# EAGLE design Arduino_Nano (EAGLE 9.6.2)
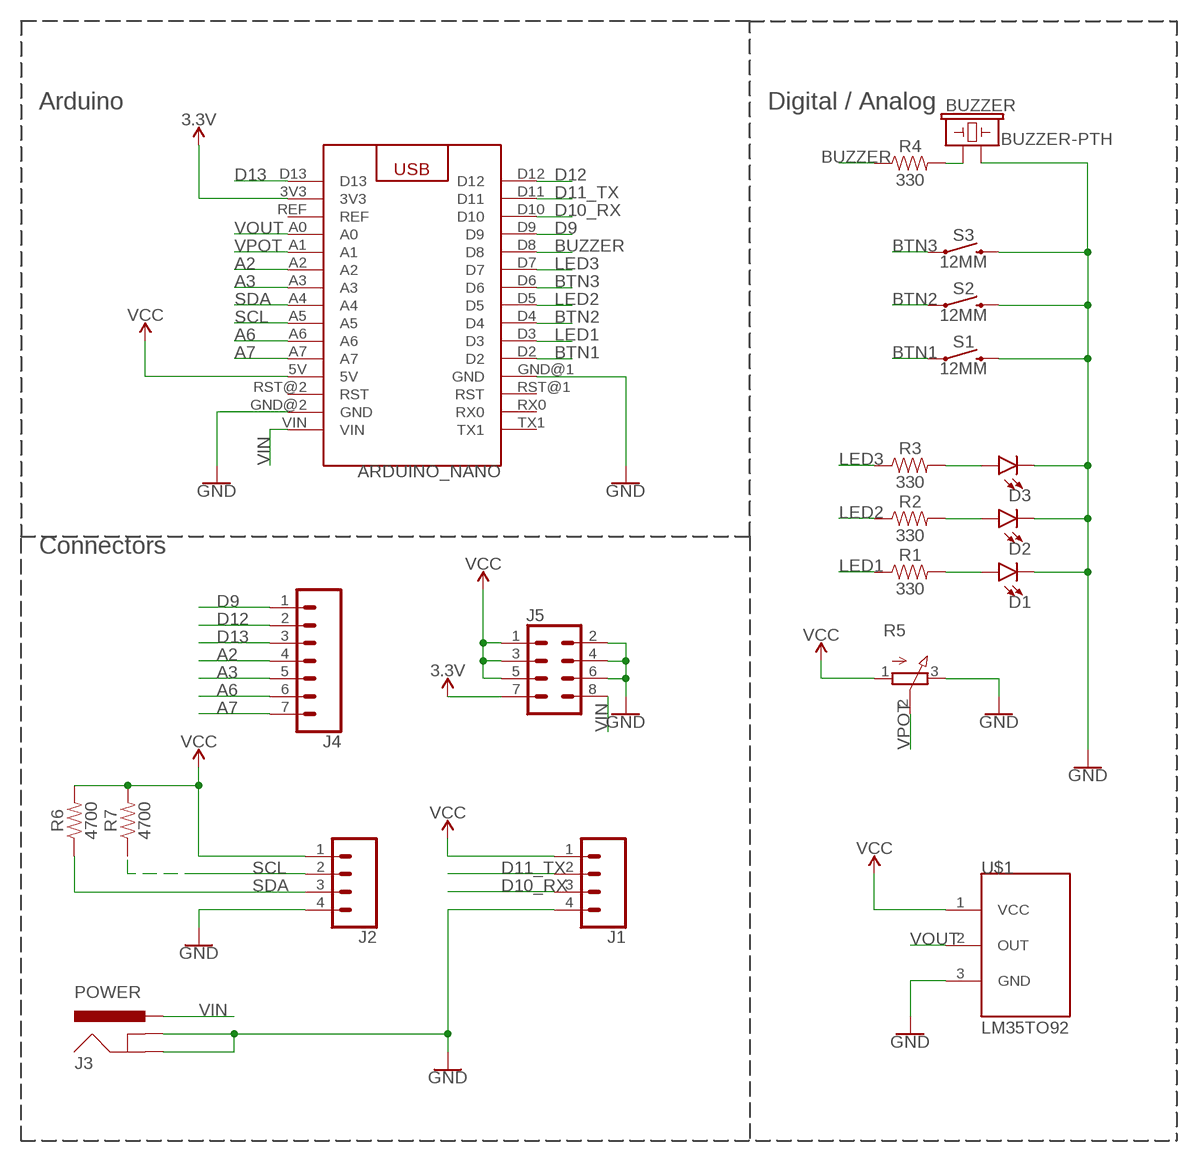
[diagram p0: schematic, sheet 1]

## Parts
ARDUINO_NANO  ARDUINO_NANO  [ARDUINO_NANO]
BUZZER  BUZZER-PTH  [BUZZER-12MM]
D1  LED-3MM-NO_SILK  [LED_3MM-NS]
D2  LED-3MM-NO_SILK  [LED_3MM-NS]
D3  LED-3MM-NO_SILK  [LED_3MM-NS]
J1  CONN_04PTH  [1X04]
J2  CONN_04PTH  [1X04]
J3  POWER  POWER_JACK  [POWER_JACK_PTH]
J4  CONN_07  [1X07]
J5  CONN_04X2  [2X4]
R1  330  1KOHM-HORIZ-1/4W-1%  [AXIAL-0.3]
R2  330  1KOHM-HORIZ-1/4W-1%  [AXIAL-0.3]
R3  330  1KOHM-HORIZ-1/4W-1%  [AXIAL-0.3]
R4  330  1KOHM-HORIZ-1/4W-1%  [AXIAL-0.3]
R5  3RP/1610N  [3RP/1610N]
R6  4700  1KOHM-HORIZ-1/4W-1%  [AXIAL-0.3]
R7  4700  1KOHM-HORIZ-1/4W-1%  [AXIAL-0.3]
S1  12MM  MOMENTARY-SWITCH-SPST-PTH-12MM  [TACTILE_SWITCH_PTH_12MM]
S2  12MM  MOMENTARY-SWITCH-SPST-PTH-12MM  [TACTILE_SWITCH_PTH_12MM]
S3  12MM  MOMENTARY-SWITCH-SPST-PTH-12MM  [TACTILE_SWITCH_PTH_12MM]
U$1  LM35TO92  [LM35TO92]

## Nets
3.3V: ARDUINO_NANO.3V3 J5.7
A2: ARDUINO_NANO.A2 J4.4
A3: ARDUINO_NANO.A3 J4.5
A6: ARDUINO_NANO.A6 J4.6
A7: ARDUINO_NANO.A7 J4.7
BTN1: ARDUINO_NANO.D2 S1.1
BTN2: ARDUINO_NANO.D4 S2.1
BTN3: ARDUINO_NANO.D6 S3.1
BUZZER: ARDUINO_NANO.D8 R4.P$1
D9: ARDUINO_NANO.D9 J4.1
D10_RX: ARDUINO_NANO.D10 J1.3
D11_TX: ARDUINO_NANO.D11 J1.2
D12: ARDUINO_NANO.D12 J4.2
D13: ARDUINO_NANO.D13 J4.3
GND: ARDUINO_NANO.GND@2(GND) BUZZER.- D1.K(C) D2.K(C) D3.K(C) J1.4 J2.4 J3.GND J3.GNDBREAK J5.2 J5.4 J5.6 R5.3(E) S1.3 S2.3 S3.3 U$1.3(GND)
LED1: ARDUINO_NANO.D3 R1.P$1
LED2: ARDUINO_NANO.D5 R2.P$1
LED3: ARDUINO_NANO.D7 R3.P$1
N$1: BUZZER.+ R4.P$2
N$2: ARDUINO_NANO.GND@1(GND) ; supply symbol labelled GND
N$3: D3.A R3.P$2
N$4: D2.A R2.P$2
N$5: D1.A R1.P$2
SCL: ARDUINO_NANO.A5 J2.2 R7.P$1
SDA: ARDUINO_NANO.A4 J2.3 R6.P$1
VCC: ARDUINO_NANO.5V J1.1 J2.1 J5.1 J5.3 J5.5 R5.1(A) R6.P$2 R7.P$2 U$1.1(VCC)
VIN: ARDUINO_NANO.VIN J3.PWR J5.8
VOUT: ARDUINO_NANO.A0 U$1.2(OUT)
VPOT: ARDUINO_NANO.A1 R5.2(S)
Unconnected: ARDUINO_NANO.REF ARDUINO_NANO.RST@1(RST) ARDUINO_NANO.RST@2(RST) ARDUINO_NANO.RX0 ARDUINO_NANO.TX1

## Notes on the sheet
- Arduino | Digital / Analog
- Connectors

## Library data of the parts
ARDUINO_NANO = LRTlib:ARDUINO_NANO: Arduino Nano Device
BUZZER = SparkFun-Electromechanical:BUZZER: Buzzer Small round buzzers that operate around the audible 2kHz range. You can use these as speakers to create simple music or user interfaces. Variant Overview: PTH - Mini Speaker - PC Mount 12mm 2.048kHz <https://www.sparkfun.com/products/7950> PTH_KIT - Mini Speaker - PC Mount 12mm 2.048kHz <https://www.sparkfun.com/products/7950> KIT simplifies soldering by adding stop mask to one side of the pads. PTH_NO_SILK - Mini Speaker - PC Mount 12mm 2.048kHz <https://www.sparkfun.com/products/7950> No silkscreen indicator of buzzer outline. PTH_KIT_NO_SILK - Mini Speaker - PC Mount 12mm 2.048kHz <https://www.sparkfun.com/products/7950> KIT package w/o silkscreen SMD - Buzzer Audio Magnetic (CCV-084B16) SMD buzzer used on, e.g. the LilyPad Buzzer <https://www.sparkfun.com/products/8463> and RFID USB Reader <https://www.sparkfun.com/products/9963>. SMD_KIT - Buzzer Audio Magnetic (CCV-084B16) SMD Buzzer with elongated pins to make soldering easier. Used on the SparkFun Simon Says - Surface Mount Soldering Kit <https://www.sparkfun.com/products/10935>. SMD-SQUARE - Buzzer Audio Magnetic (COMP-15701) SMT square buzzer with one chamfered corner.; PROD_ID: COMP-08253; SF_SKU: COM-07950
D1-D3 = SparkFun-LED:LED: LED (Generic) Standard schematic elements and footprints for 5mm, 3mm, 1206, and 0603 sized LEDs. Generic LEDs with no color specified.
J1 J2 = SparkFun-Connectors:CONN_04: Multi connection point. Often used as Generic Header-pin footprint for 0.1 inch spaced/style header connections On any of the 0.1 inch spaced packages, you can populate with these: Break Away Headers - Straight <https://www.sparkfun.com/products/116> (PRT-00116) Break Away Male Headers - Right Angle <https://www.sparkfun.com/products/553> (PRT-00553) Female Headers <https://www.sparkfun.com/products/115> (PRT-00115) Break Away Headers - Machine Pin <https://www.sparkfun.com/products/117> (PRT-00117) Break Away Female Headers - Swiss Machine Pin <https://www.sparkfun.com/products/743> (PRT-00743) For SCREWTERMINALS and SPRING TERMINALS visit here: Screw Terimnals on SparkFun.com <https://www.sparkfun.com/search/results?term=Screw+Terminals> (5mm/3.5mm/2.54mm spacing) This device is also useful as a general connection point to wire up your design to another part of your project. Our various solder wires solder well into these plated through hole pads. Hook-Up Wire - Assortment (Stranded, 22 AWG) <https://www.sparkfun.com/products/11375> (PRT-11375) Hook-Up Wire - Assortment (Solid Core, 22 AWG) <https://www.sparkfun.com/products/11367> (PRT-11367) View the entire wire category on our website here <https://www.sparkfun.com/categories/141> Special notes: Molex polarized connector foot print use with SKU : PRT-08231 with associated crimp pins and housings. 1MM SMD Version SKU: PRT-10208; PROD_ID: CONN-09696
J3 = SparkFun-Connectors:POWER_JACK: Power Jack Connector This is the standard 5.5mm barrel jack for power. The PTH is the most common, proven, reliable, footprint. The Slot footprint only works if the mill layer is transmitted to the PCB fab house so be warned. Here are the connectors we sell at SparkFun: DC Barrel Power Jack/Connector <https://www.sparkfun.com/products/119> (PRT-00119) DC Barrel Power Jack/Connector (SMD) <https://www.sparkfun.com/products/12748> (PRT-12748) DC Barrel Jack Adapter - Breadboard Compatible <https://www.sparkfun.com/products/10811> (PRT-10811) It is used on this SparkFun product (and many, many others): SparkFun RedBoard - Programmed with Arduino <https://www.sparkfun.com/products/12757> (DEV-12757) Also, if you need a mating power supply or connector, please check these out: Wall Adapter Power Supply - 9VDC 650mA <https://www.sparkfun.com/products/298> (TOL-00298) DC Barrel Jack Adapter - Male <https://www.sparkfun.com/products/10287> (PRT-10287); PROD_ID: CONN-08197
J4 = SparkFun-Connectors:CONN_07: Multi connection point. Often used as Generic Header-pin footprint for 0.1 inch spaced/style header connections On any of the 0.1 inch spaced packages, you can populate with these: Break Away Headers - Straight <https://www.sparkfun.com/products/116> (PRT-00116) Break Away Male Headers - Right Angle <https://www.sparkfun.com/products/553> (PRT-00553) Female Headers <https://www.sparkfun.com/products/115> (PRT-00115) Break Away Headers - Machine Pin <https://www.sparkfun.com/products/117> (PRT-00117) Break Away Female Headers - Swiss Machine Pin <https://www.sparkfun.com/products/743> (PRT-00743) For SCREWTERMINALS and SPRING TERMINALS visit here: Screw Terimnals on SparkFun.com <https://www.sparkfun.com/search/results?term=Screw+Terminals> (5mm/3.5mm/2.54mm spacing) This device is also useful as a general connection point to wire up your design to another part of your project. Our various solder wires solder well into these plated through hole pads. Hook-Up Wire - Assortment (Stranded, 22 AWG) <https://www.sparkfun.com/products/11375> (PRT-11375) Hook-Up Wire - Assortment (Solid Core, 22 AWG) <https://www.sparkfun.com/products/11367> (PRT-11367) View the entire wire category on our website here <https://www.sparkfun.com/categories/141> Special notes: Molex polarized connector foot print use with SKU : PRT-08231 with associated crimp pins and housings. 1MM SMD Version SKU: PRT-10208 NOTES ON THE VARIANTS LOCK and LOCK_LONGPADS... This footprint was designed to help hold the alignment of a through-hole component (i.e. 6-pin header) while soldering it into place. You may notice that each hole has been shifted either up or down by 0.005 of an inch from it's more standard position (which is a perfectly straight line). This slight alteration caused the pins (the squares in the middle) to touch the edges of the holes. Because they are alternating, it causes a "brace" to hold the component in place. 0.005 has proven to be the perfect amount of "off-center" position when using our standard breakaway headers. Although looks a little odd when you look at the bare footprint, once you have a header in there, the alteration is very hard to notice. Also,if you push a header all the way into place, it is covered up entirely on the bottom side.
J5 = SparkFun-Connectors:CONN_04X2: Multi connection point. Often used as Generic Header-pin footprint for 0.1 inch spaced/style header connections On any of the 0.1 inch spaced packages, you can populate with these: Break Away Headers - Straight <https://www.sparkfun.com/products/116> (PRT-00116) Break Away Male Headers - Right Angle <https://www.sparkfun.com/products/553> (PRT-00553) Female Headers <https://www.sparkfun.com/products/115> (PRT-00115) Break Away Headers - Machine Pin <https://www.sparkfun.com/products/117> (PRT-00117) Break Away Female Headers - Swiss Machine Pin <https://www.sparkfun.com/products/743> (PRT-00743)
R1-R4 R6 R7 = SparkFun-Resistors:1KOHM: 1kΩ resistor A resistor is a passive two-terminal electrical component that implements electrical resistance as a circuit element. Resistors act to reduce current flow, and, at the same time, act to lower voltage levels within circuits. - Wikipedia; PROD_ID: RES-12182; VALUE: 1k
R5 = pot:3RP/1610N: 16mm Potentiometer one level Source: http://www.alphapotentiometers.net/html/16mm_pot_2.html
S1-S3 = SparkFun-Switches:MOMENTARY-SWITCH-SPST: Momentary Switch (Pushbutton) - SPST Normally-open (NO) SPST momentary switches (buttons, pushbuttons). Variants PTH-12MM - 12mm square, through-hole Momentary Pushbutton Switch - 12mm Square <https://www.sparkfun.com/products/9190> (COM-09190) PTH-6.0MM, PTH-6.0MM-KIT - 6.0mm square, through-hole Mini Pushbutton Switch <https://www.sparkfun.com/products/97> (COM-00097) KIT package intended for soldering kit's - only one side of pads' copper is exposed. PTH-RIGHT-ANGLE-KIT - Right-angle, through-hole Right Angle Tactile Button <https://www.sparkfun.com/products/10791> - Used on SparkFun BigTime Watch Kit <https://www.sparkfun.com/products/11734> SMD-12MM - 12mm square, surface-mount Tactile Button - SMD (12mm) <https://www.sparkfun.com/products/12993> (COM-12993) Used on SparkFun PicoBoard <https://www.sparkfun.com/products/11888> SMD-4.5MM - 4.5mm Square Trackball Switch Used on SparkFun Blackberry Trackballer Breakout <https://www.sparkfun.com/products/13169> SMD-4.6MMX2.8MM - 4.60mm x 2.80mm, surface mount Used on SparkFun Pro Micro - RP2040 <https://www.sparkfun.com/products/17717> SMD-5.2MM, SMD-5.2-REDUNDANT - 5.2mm square, surface-mount Mini Pushbutton Switch - SMD <https://www.sparkfun.com/products/8720> (COM-08720) Used on Arduino Pro Mini <https://www.sparkfun.com/products/11114> REDUNDANT package connects both switch circuits together SMD-6.0X3.5MM - 6.0 x 3.5mm, surface mount Momentary Reset Switch SMD <https://www.sparkfun.com/products/8229> (COM-08229) SMD-6.2MM-TALL - 6.2mm square, surface mount Tactile Button - SMD (6mm) <https://www.sparkfun.com/products/12992> Used on SparkFun Digital Sandbox <https://www.sparkfun.com/products/12651> SMD-RIGHT-ANGLE - Right-angle, surface mount Used on SparkFun Block for Intel® Edison - Arduino <https://www.sparkfun.com/products/13036>; PROD_ID: SWCH-09185; SF_SKU: COM-09190
U$1 = LRTlib:LM35TO92

## Board
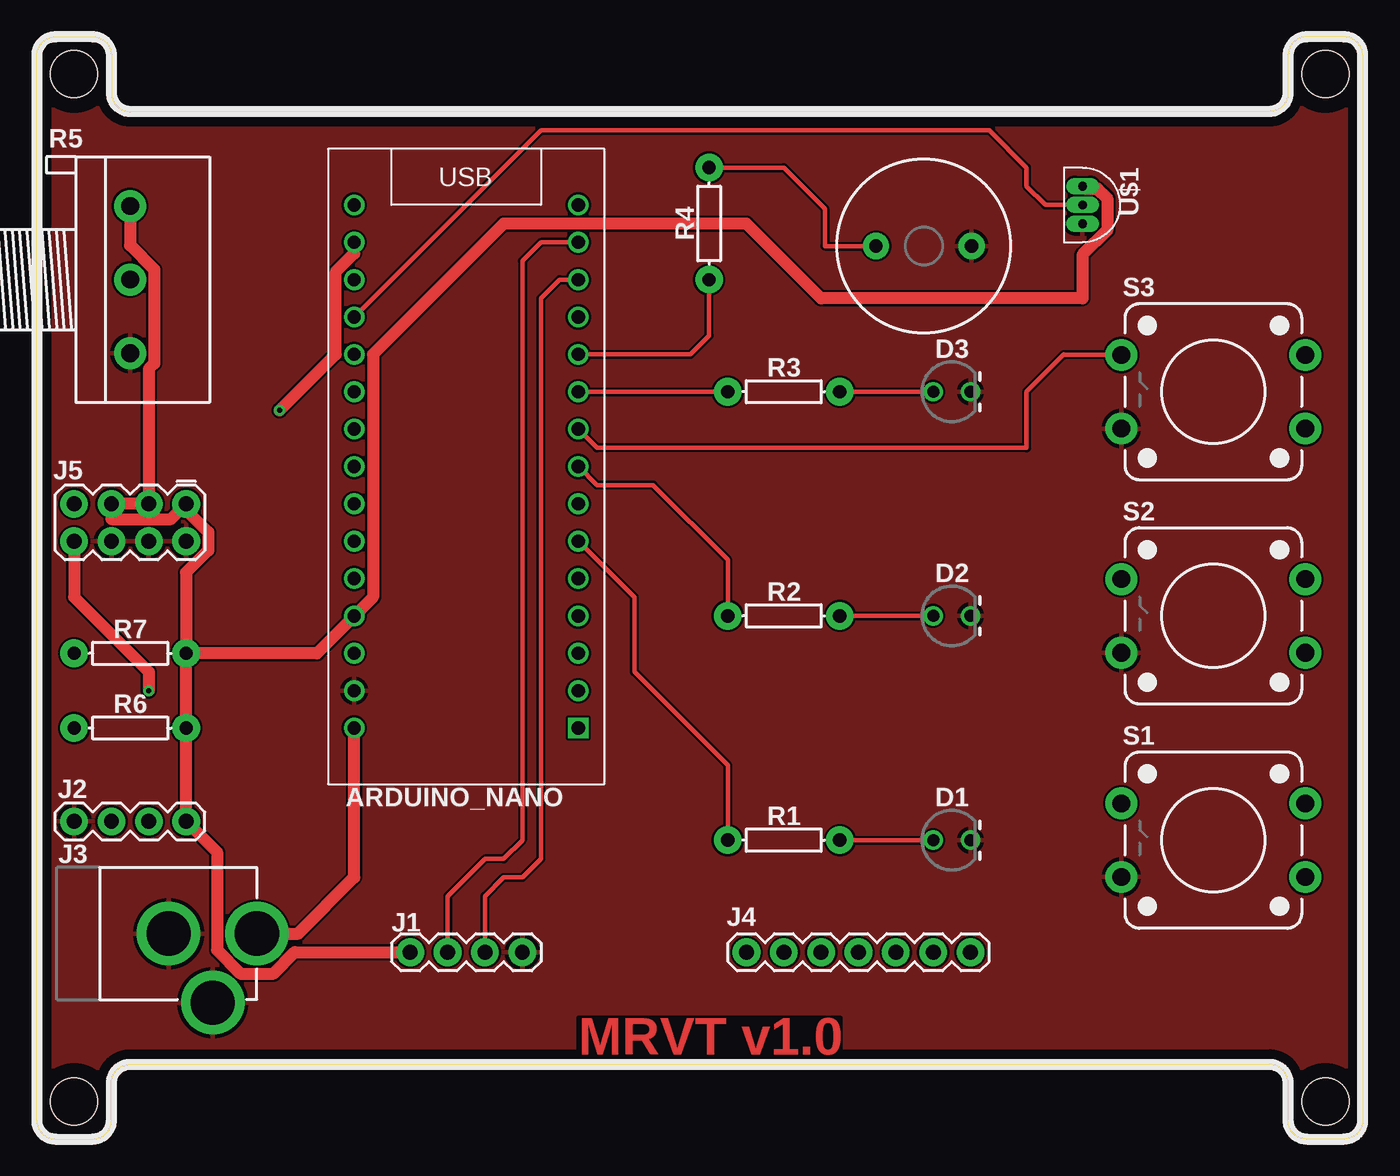
[diagram p1: board, top side]
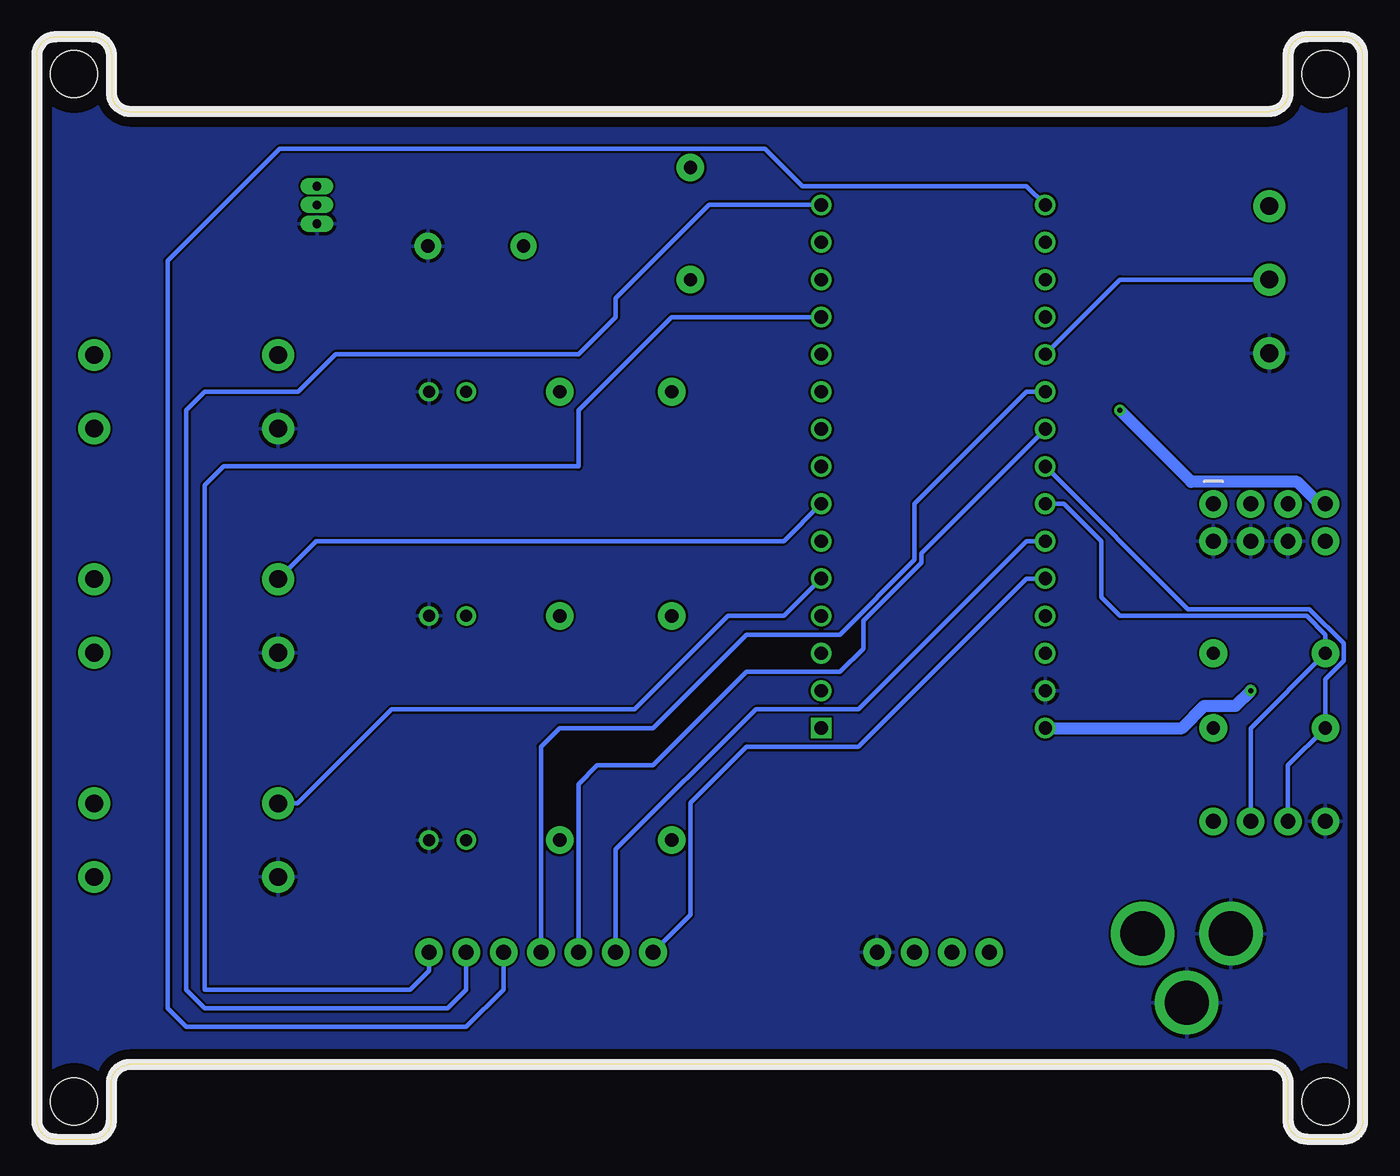
[diagram p2: board, bottom side, seen from below]

Size 90.17 x 74.93 mm. Coordinates in mm from the lower left corner, seen from the top.
Outline: 88.9,0 86.36,0 arc-90 85.09,1.27 85.09,3.81 arc90 83.82,5.08 6.35,5.08 arc90 5.08,3.81 5.08,1.27 arc-90 3.81,0 1.27,0 arc-90 0,1.27 0,73.66 arc-90 1.27,74.93 3.81,74.93 arc-90 5.08,73.66 5.08,71.12 arc90 6.35,69.85 83.82,69.85 arc90 85.09,71.12 85.09,73.66 arc-90 86.36,74.93 88.9,74.93 arc-90 90.17,73.66 90.17,1.27 arc-90 88.9,0
Copper layers (1*16): Top 0.035mm / dielectric 1.5mm / Bottom 0.035mm
Design rules "default": minimum track width 6mil, minimum drill 0.35mm, track to track 6mil, track to pad 6mil, pad to pad 6mil, via to via 6mil, smd to smd 6mil, copper to edge 40mil, drill to drill 6mil, minimum pad ring 10mil, minimum via ring 8mil, stop-mask expansion 4mil, vias tented up to drill 0mil, thermal gap 10mil
Holes 3.2 mm at 2.54,72.39 87.63,72.39 87.63,2.54 2.54,2.54

### Footprints (pad centres in the part's own frame; a part is rotated, then mirrored left to right if it is on the bottom)
ARDUINO_NANO = drill 0.9: 3V3 7.62,-15.24; 5V 7.62,10.16; A0 7.62,-10.16; A1 7.62,-7.62; A2 7.62,-5.08; A3 7.62,-2.54; A4 7.62,0; A5 7.62,2.54; A6 7.62,5.08; A7 7.62,7.62; D2 -7.62,7.62; D3 -7.62,5.08; D4 -7.62,2.54; D5 -7.62,0; D6 -7.62,-2.54; D7 -7.62,-5.08; D8 -7.62,-7.62; D9 -7.62,-10.16; D10 -7.62,-12.7; D11 -7.62,-15.24; D12 -7.62,-17.78; D13 7.62,-17.78; GND@1 -7.62,10.16; GND@2 7.62,15.24; REF 7.62,-12.7; RST@1 -7.62,12.7; RST@2 7.62,12.7; RX0 -7.62,15.24; VIN 7.62,17.78 | drill 0.9 square: TX1 -7.62,17.78
BUZZER-12MM = drill 0.9 pad 1.778: + 3.25,0; - -3.25,0
LED_3MM-NS = drill 0.813: A -1.27,0; K 1.27,0
1X04 = drill 1.016 pad 1.88: 1 0,0; 2 2.54,0; 3 5.08,0; 4 7.62,0
POWER_JACK_PTH = drill 2.997 pad 4.318: GND 0,7.7; GNDBREAK 4.7,10.7; PWR 0,13.7
1X07 = drill 1.016 pad 1.88: 1 0,0; 2 2.54,0; 3 5.08,0; 4 7.62,0; 5 10.16,0; 6 12.7,0; 7 15.24,0
2X4 = drill 1.016 pad 1.88: 1 -3.81,-1.27; 2 -3.81,1.27; 3 -1.27,-1.27; 4 -1.27,1.27; 5 1.27,-1.27; 6 1.27,1.27; 7 3.81,-1.27; 8 3.81,1.27
AXIAL-0.3 = drill 0.9 pad 1.88: P$1 -3.81,0; P$2 3.81,0
3RP/1610N = drill 1.2 pad 2.184: 1 -5,0; 2 0,0; 3 5,0
TACTILE_SWITCH_PTH_12MM = drill 1.2 pad 2.159: 1 6.25,-2.5; 2 -6.25,-2.5; 3 6.25,2.5; 4 -6.25,2.5
LM35TO92 = drill 0.6 long: 1 -1.27,0; 2 0,0; 3 1.27,0

### Placement (x,y rotation side)
ARDUINO_NANO  29.21,45.72 180 top
BUZZER  60.33,60.71 180 top
D1  62.23,20.32 0 top
D2  62.23,35.56 0 top
D3  62.23,50.8 0 top
J1  25.4,12.7 0 top
J2  10.16,21.59 180 top
J3  1.27,13.97 270 top
J4  63.5,12.7 180 top
J5  6.35,41.91 180 top
R1  50.8,20.32 0 top
R2  50.8,35.56 0 top
R3  50.8,50.8 0 top
R4  45.72,62.23 90 top
R5  6.35,58.42 270 top
R6  6.35,27.94 0 top
R7  6.35,33.02 0 top
S1  80.01,20.32 180 top
S2  80.01,35.56 180 top
S3  80.01,50.8 180 top
U$1  71.12,63.5 270 top

### Tracks (layer width: path | path; a pad name or v marks a point on that pad's centre or on a via)
3.3V  (via drill 0.35)
  Top 0.813: v16.51,49.53 20.33,53.35 20.33,58.94 21.59,60.21 ARDUINO_NANO.3V3
  Bottom 0.813: J5.7 2.96,43.18 4.46,44.68 11.66,44.68 v16.51,49.53
A2
  Bottom 0.305: ARDUINO_NANO.A2 22.86,50.8 30.48,43.18 30.48,39.37 35.56,34.29 41.91,34.29 48.26,27.94 54.61,27.94 55.88,26.67 J4.4
A3
  Bottom 0.305: J4.5 53.34,24.13 52.07,25.4 48.26,25.4 41.91,31.75 35.56,31.75 33.97,33.34 33.97,35.24 30.02,39.18 30.02,39.83 ARDUINO_NANO.A3
A6
  Bottom 0.305: ARDUINO_NANO.A6 22.86,40.64 34.29,29.21 41.27,29.21 50.8,19.69 J4.6
A7
  Bottom 0.305: J4.7 45.72,15.24 45.72,22.86 41.91,26.67 34.29,26.67 22.86,38.1 ARDUINO_NANO.A7
BTN1
  Bottom 0.305: S1.1 72.43,22.82 66.04,29.21 49.53,29.21 43.18,35.56 39.37,35.56 ARDUINO_NANO.D2
BTN2
  Bottom 0.305: S2.1 71.18,40.64 39.37,40.64 ARDUINO_NANO.D4
BTN3
  Top 0.305: S3.1 69.89,53.3 69.85,53.34 67.31,50.8 67.31,46.99 38.1,46.99 ARDUINO_NANO.D6
BUZZER
  Top 0.305: ARDUINO_NANO.D8 44.45,53.34 45.72,54.61 R4.P$1
D9
  Bottom 0.305: ARDUINO_NANO.D9 46.99,55.88 53.34,49.53 53.34,45.72 77.47,45.72 78.74,44.45 78.74,10.16 64.77,10.16 63.5,11.43 J4.1
D10_RX
  Top 0.305: J1.3 30.48,16.51 31.75,17.78 33.02,17.78 34.29,19.05 34.29,57.15 35.56,58.42 ARDUINO_NANO.D10
D11_TX
  Top 0.305: ARDUINO_NANO.D11 34.29,60.96 33.02,59.69 33.02,20.32 31.75,19.05 30.48,19.05 27.94,16.51 J1.2
D12
  Bottom 0.305: ARDUINO_NANO.D12 44.45,63.5 50.8,57.15 50.8,55.88 53.34,53.34 69.85,53.34 72.39,50.8 78.74,50.8 80.01,49.53 80.01,10.16 78.74,8.89 62.23,8.89 60.96,10.16 J4.2
D13
  Bottom 0.305: ARDUINO_NANO.D13 22.86,64.77 38.1,64.77 40.64,67.31 73.66,67.31 81.28,59.69 81.28,8.89 80.01,7.62 60.96,7.62 58.42,10.16 J4.3
GND
  pour Top: 0,-2.54 92.71,-2.54 92.71,77.47 -2.54,77.47 -2.54,-2.54
  pour Bottom: -5.08,77.47 -5.08,-5.08 95.25,-5.08 95.25,80.01 -5.08,80.01
LED1
  Top 0.305: R1.P$1 46.99,25.4 40.64,31.75 40.64,36.83 ARDUINO_NANO.D3
LED2
  Top 0.305: R2.P$1 46.99,39.37 41.91,44.45 38.1,44.45 ARDUINO_NANO.D5
LED3
  Top 0.305: ARDUINO_NANO.D7 R3.P$1
N$1
  Top 0.305: BUZZER.+ 53.59,60.71 53.59,63.25 50.8,66.04 R4.P$2
N$3
  Top 0.305: R3.P$2 D3.A
N$4
  Top 0.305: R2.P$2 D2.A
N$5
  Top 0.305: R1.P$2 D1.A
SCL
  Bottom 0.305: J2.2 7.62,27.94 R7.P$1 2.54,34.29 3.81,35.56 16.51,35.56 17.78,36.83 17.78,40.64 20.32,43.18 ARDUINO_NANO.A5
SDA
  Bottom 0.305: ARDUINO_NANO.A4 11.89,36.02 3.62,36.02 1.29,33.69 1.29,32.5 2.54,31.26 R6.P$1 5.08,25.4 J2.3
VCC
  Top 0.152: 22.86,36.83 ARDUINO_NANO.5V 19.05,33.02
  Top 0.813: U$1.1 71.28,64.61 72.14,64.61 72.79,63.96 72.79,61.77 71.12,60.1 71.12,57.15 53.34,57.15 48.26,62.23 31.75,62.23 22.86,53.34 22.86,36.83 19.05,33.02 R7.P$2 | R5.1 6.35,60.75 8,59.1 8,52.74 7.62,52.35 J5.3 J5.5 5.08,42.14 9.12,42.14 J5.1 10.16,42.76 11.66,41.26 11.66,40.02 10.16,38.52 R7.P$2 | R7.P$2 R6.P$2 J2.1 12.25,19.5 12.25,12.84 13.84,11.25 16.1,11.25 17.54,12.7 J1.1
VIN  (via drill 0.35)
  Top 0.813: J3.PWR 17.78,13.97 21.59,17.78 ARDUINO_NANO.VIN | J5.8 2.54,36.83 7.62,31.75 v7.62,30.48
  Bottom 0.813: ARDUINO_NANO.VIN 12.28,27.94 10.78,29.44 8.66,29.44 v7.62,30.48
VOUT
  Top 0.305: ARDUINO_NANO.A0 34.29,68.58 64.77,68.58 67.31,66.04 67.31,64.77 68.58,63.5 U$1.2
VPOT
  Bottom 0.305: ARDUINO_NANO.A1 16.51,58.42 R5.2

### Text on the board
Top: MRVT v1.0
tStop: MRVT v1.0